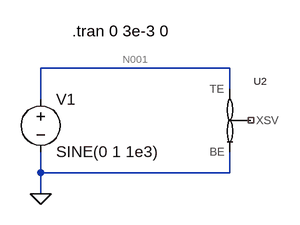
[diagram p0: schematic generalized_memristor.asc]
generalized_memristor.asc, the LTspice schematic file:
Version 4
SHEET 1 880 680
WIRE 400 48 112 48
WIRE 400 80 400 48
WIRE 112 96 112 48
WIRE 112 208 112 176
WIRE 400 208 400 176
WIRE 400 208 112 208
WIRE 112 240 112 208
FLAG 112 240 0
SYMBOL voltage 112 80 R0
WINDOW 123 0 0 Left 0
WINDOW 39 0 0 Left 0
SYMATTR InstName V1
SYMATTR Value SINE(0 1 1e3)
SYMBOL MEM_YAKOPCIC 400 128 R0
SYMATTR InstName U2
TEXT 160 -8 Left 2 !.tran 0 3e-3 0

The netlist it stands for:
* generalized_memristor.asc
V1 N001 0 SINE(0 1 1e3)
XU2 N001 0 NC_01 MEM_YAKOPCIC  ; pins TE BE XSV
.tran 0 3e-3 0
.lib MEM_YAKOPCIC.sub
.backanno
.end

* Results of the author's LTspice run, read from the files saved beside the schematic
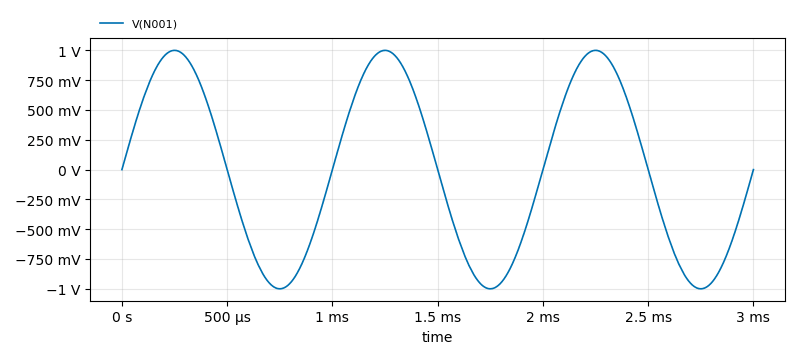
[diagram p1: Transient Analysis of generalized_memristor.asc, plotted from the saved traces]
* Transient Analysis, 1 run:
*   V(N001): min -1 V, max 1 V, average 113.8 µV, rms 707.4 mV, last 0 V